# EAGLE design riffle-beta-0.1.7.1 (EAGLE 7.5.0)
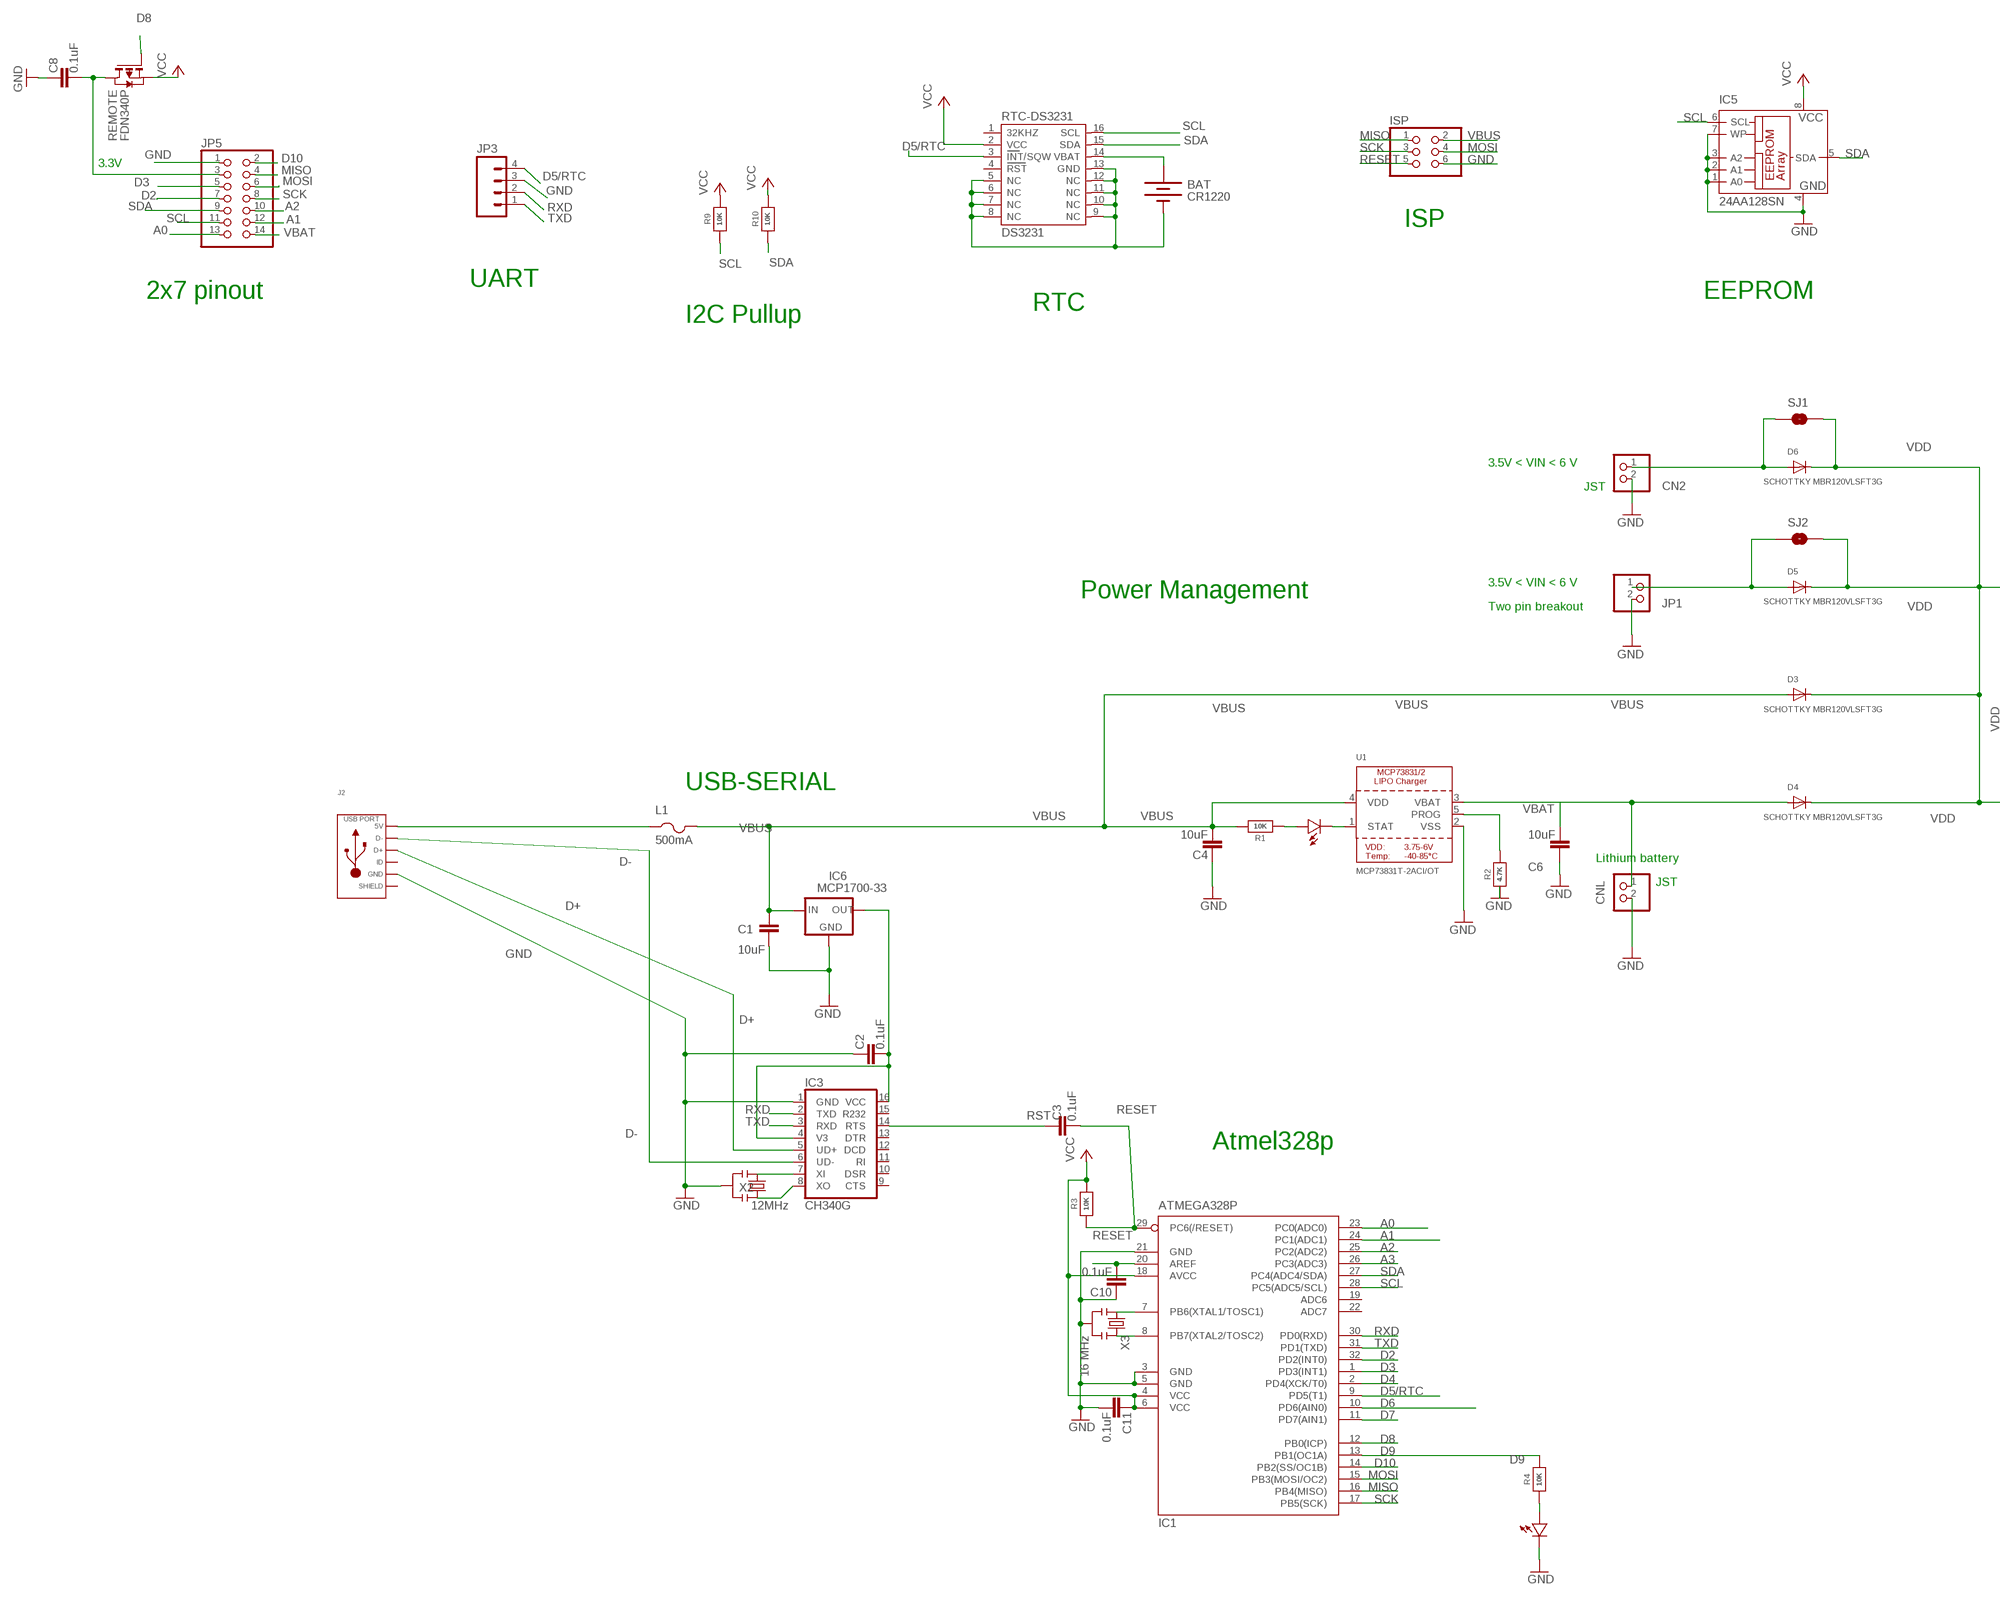
[diagram p0: schematic, sheet 1, part 1 of 2]
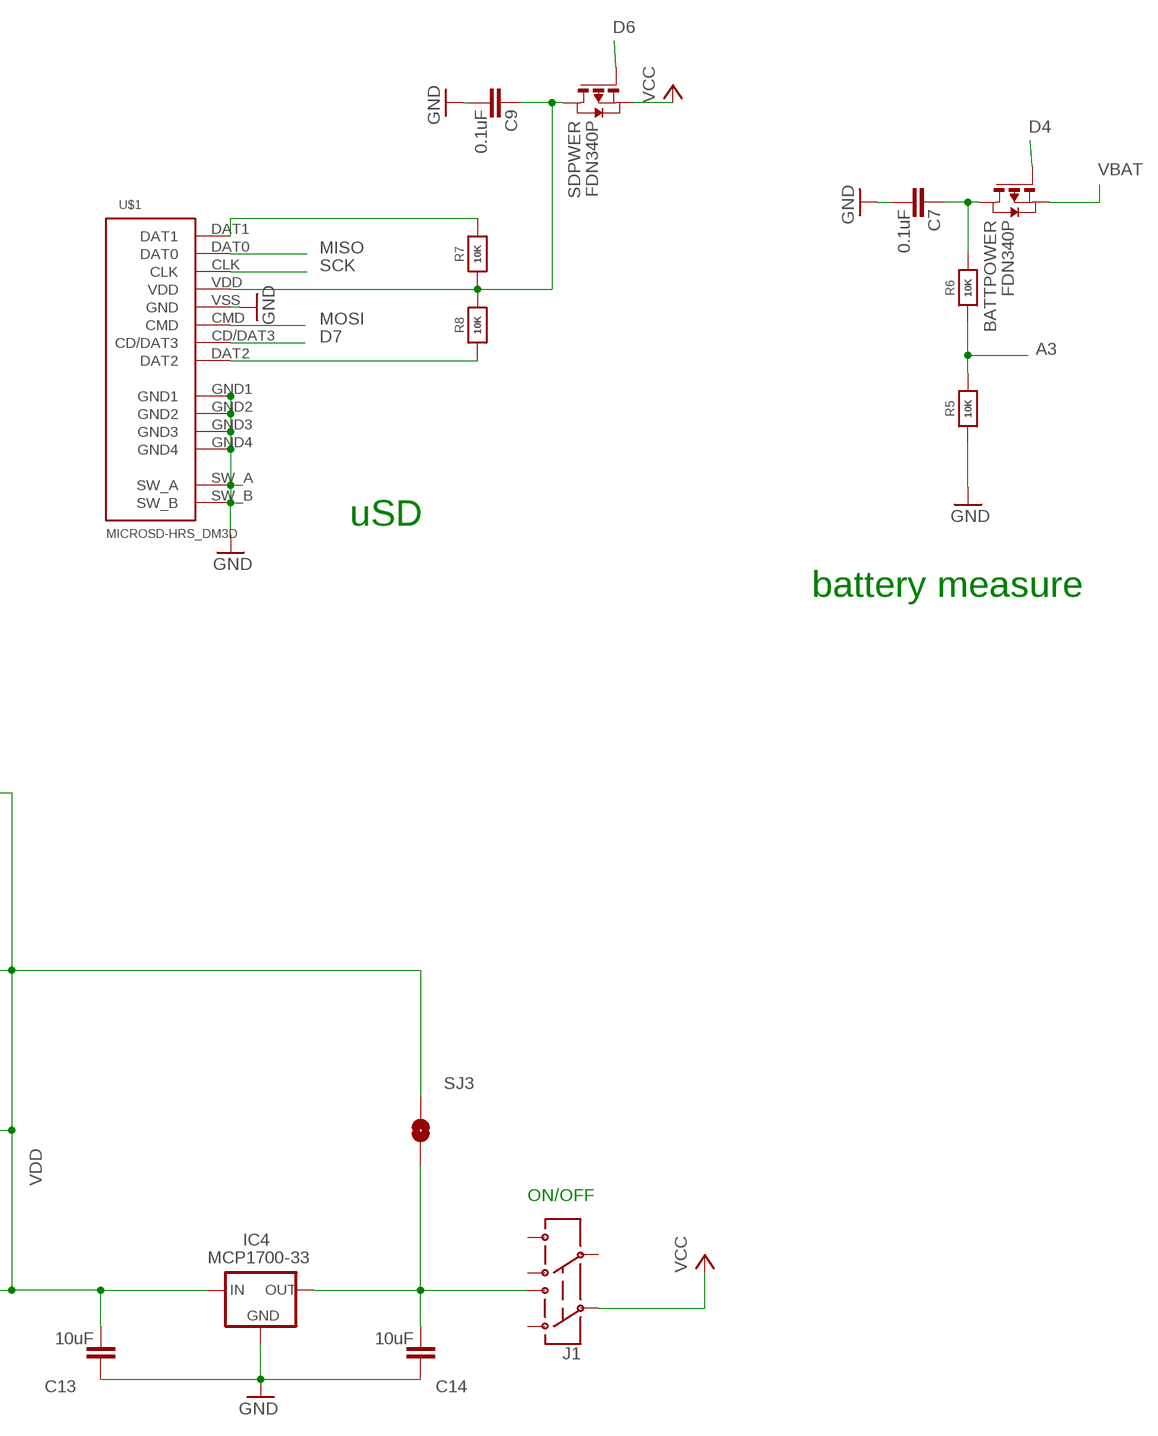
[diagram p1: schematic, sheet 1, part 2 of 2]

## Parts
BAT  CR1220  BATTERYBATTERY_12MM_SMT  [BATTCON_12MM_SMT]
BATTPOWER  FDN340P  PMOSSOT23  [SOT-23]
C1  10uF  CAP0603-CAP  [0603-CAP]
C2  0.1uF  CAP0603-CAP  [0603-CAP]
C3  0.1uF  CAP0603-CAP  [0603-CAP]
C4  10uF  CAP0603-CAP  [0603-CAP]
C6  10uF  CAP0603-CAP  [0603-CAP]
C7  0.1uF  CAP0603-CAP  [0603-CAP]
C8  0.1uF  CAP0603-CAP  [0603-CAP]
C9  0.1uF  CAP0603-CAP  [0603-CAP]
C10  0.1uF  CAP0603-CAP  [0603-CAP]
C11  0.1uF  CAP0603-CAP  [0603-CAP]
C13  10uF  CAP0603-CAP  [0603-CAP]
C14  10uF  CAP0603-CAP  [0603-CAP]
CN2  JST_2PIN-SMT-RA  [JST-PH-2-SMT-RA]
CNL  JST_2PIN-SMT-RA  [JST-PH-2-SMT-RA]
D1  LED0603  [0603-LED]
D2  LED0603  [0603-LED]
D3  SCHOTTKY MBR120VLSFT3G  DIODE_SOD-123FL  [SOD-123FL]
D4  SCHOTTKY MBR120VLSFT3G  DIODE_SOD-123FL  [SOD-123FL]
D5  SCHOTTKY MBR120VLSFT3G  DIODE_SOD-123FL  [SOD-123FL]
D6  SCHOTTKY MBR120VLSFT3G  DIODE_SOD-123FL  [SOD-123FL]
IC1  ATMEGA328P  MEGA8-AI  [TQFP32-08]
IC3  CH340G  [SO16]
IC4  MCP1700-33  MCP1700SOT89  [SOT89]
IC5  24AA128SN  [SO-08]
IC6  MCP1700-33  MCP1700SOT89  [SOT89]
ISP  PINHD-2X3  [2X03]
J1  AYZ0202  [AYZ0202]
J2  USB_MICRO_RIGHT  [MICROUSB-RIGHT]
JP1  PINHD-1X2  [1X02]
JP3  M04SMD  [1X04-SMD]
JP5  PINHD-2X7  [2X07]
L1  500mA  PTCFUSE-1206  [R1206]
R1  10K  RESISTOR_0603_NOOUT  [0603-NO]
R2  4.7K  RESISTOR_0603_NOOUT  [0603-NO]
R3  10K  RESISTOR_0603_NOOUT  [0603-NO]
R4  10K  RESISTOR_0603_NOOUT  [0603-NO]
R5  10K  RESISTOR_0603_NOOUT  [0603-NO]
R6  10K  RESISTOR_0603_NOOUT  [0603-NO]
R7  10K  RESISTOR_0603_NOOUT  [0603-NO]
R8  10K  RESISTOR_0603_NOOUT  [0603-NO]
R9  10K  RESISTOR_0603_NOOUT  [0603-NO]
R10  10K  RESISTOR_0603_NOOUT  [0603-NO]
REMOTE  FDN340P  PMOSSOT23  [SOT-23]
RTC-DS3231  DS3231  [DS3231]
SDPWER  FDN340P  PMOSSOT23  [SOT-23]
SJ1  SOLDERJUMPERNO  [SJ_2S-NO]
SJ2  SOLDERJUMPERNO  [SJ_2S-NO]
SJ3  SOLDERJUMPERNO  [SJ_2S-NO]
U1  MCP73831T-2ACI/OT  MCP73831/2  [SOT23-5]
U$1  MICROSD-HRS_DM3D  [DM3D]
X2  12MHz  RESONATORSMD  [RESONATOR-SMD]
X3  16 MHz  RESONATORSMD  [RESONATOR-SMD]

## Nets
A0: IC1.23(PC0(ADC0)) JP5.13
A1: IC1.24(PC1(ADC1)) JP5.12
A2: IC1.25(PC2(ADC2)) JP5.10
A3: IC1.26(PC3(ADC3)) R5.2 R6.1
AREF: C10.1 IC1.20(AREF)
D2: IC1.32(PD2(INT0)) JP5.7
D3: IC1.1(PD3(INT1)) JP5.5
D4: BATTPOWER.3(G) IC1.2(PD4(XCK/T0))
D5/RTC: IC1.9(PD5(T1)) JP3.4 RTC-DS3231.3(INT/SQW)
D6: IC1.10(PD6(AIN0)) SDPWER.3(G)
D7: IC1.11(PD7(AIN1)) U$1.CD/DAT3
D8: IC1.12(PB0(ICP)) REMOTE.3(G)
D9: IC1.13(PB1(OC1A)) R4.2
D10: IC1.14(PB2(SS/OC1B)) JP5.2
D+: IC3.5(UD+) J2.3(D+)
D-: IC3.6(UD-) J2.2(D-)
GND: BAT.P$1(-) C1.1 C2.2 C4.2 C6.2 C7.1 C8.2 C9.1 C10.2 C11.1 C13.2 C14.2 CN2.2 CNL.2 D2.MINUS IC1.3(GND) IC1.5(GND) IC1.21(GND) IC3.1(GND) IC4.1(GND) IC5.1(A0) IC5.2(A1) IC5.3(A2) IC5.4(GND) IC5.7(WP) IC6.1(GND) ISP.6 J2.5(GND) JP1.2 JP3.3 JP5.1 R2.1 R5.1 RTC-DS3231.5(NC) RTC-DS3231.6(NC) RTC-DS3231.7(NC) RTC-DS3231.8(NC) RTC-DS3231.9(NC) RTC-DS3231.10(NC) RTC-DS3231.11(NC) RTC-DS3231.12(NC) RTC-DS3231.13(GND) U1.2(VSS) U$1.GND1 U$1.GND2 U$1.GND3 U$1.GND4 U$1.SW_A U$1.SW_B U$1.VSS(GND) X2.2 X3.2
MISO: IC1.16(PB4(MISO)) ISP.1 JP5.4 U$1.DAT0
MOSI: IC1.15(PB3(MOSI/OC2)) ISP.4 JP5.6 U$1.CMD
N$2: IC1.7(PB6(XTAL1/TOSC1)) X3.1
N$3: IC1.8(PB7(XTAL2/TOSC2)) X3.3
N$4: C9.2 R7.1 R8.2 SDPWER.1(D) U$1.VDD
N$5: D1.MINUS U1.1(STAT)
N$6: R2.2 U1.5(PROG)
N$7: C8.1 JP5.3 REMOTE.1(D)
N$8: C2.1 IC3.4(V3) IC3.16(VCC) IC6.3(OUT)
N$9: J2.1(5V) L1.1
N$10: D5.A JP1.1 SJ2.1
N$11: IC3.7(XI) X2.1
N$12: CN2.1 D6.A SJ1.1
N$13: IC3.8(XO) X2.3
N$15: BATTPOWER.1(D) C7.2 R6.2
N$16: R7.2 U$1.DAT1
N$17: D2.PLUS R4.1
N$18: R8.1 U$1.DAT2
N$19: D1.PLUS R1.1
N$20: C14.1 IC4.3(OUT) J1.1 SJ3.1
RESET: C3.1 IC1.29(PC6(/RESET)) ISP.5 R3.1
RST: C3.2 IC3.14(RTS)
RTC_BATT: BAT.P$2(+) RTC-DS3231.14(VBAT)
RXD: IC1.30(PD0(RXD)) IC3.2(TXD) JP3.2
SCK: IC1.17(PB5(SCK)) ISP.3 JP5.8 U$1.CLK
SCL: IC1.28(PC5(ADC5/SCL)) IC5.6(SCL) JP5.11 R9.1 RTC-DS3231.16(SCL)
SDA: IC1.27(PC4(ADC4/SDA)) IC5.5(SDA) JP5.9 R10.1 RTC-DS3231.15(SDA)
TXD: IC1.31(PD1(TXD)) IC3.3(RXD) JP3.1
VBAT [power]: BATTPOWER.2(S) C6.1 CNL.1 D4.A JP5.14 U1.3(VBAT)
VBUS [power]: C1.2 C4.1 D3.A IC6.2(IN) ISP.2 L1.2 R1.2 U1.4(VDD)
VCC: C11.2 IC1.4(VCC) IC1.6(VCC) IC1.18(AVCC) IC5.8(VCC) J1.2 R3.2 R9.2 R10.2 REMOTE.2(S) RTC-DS3231.2(VCC) SDPWER.2(S)
VDD: C13.1 D3.C D4.C D5.C D6.C IC4.2(IN) SJ1.2 SJ2.2 SJ3.2
Unconnected: IC1.19(ADC6) IC1.22(ADC7) IC3.9(CTS) IC3.10(DSR) IC3.11(RI) IC3.12(DCD) IC3.13(DTR) IC3.15(R232) J1.3 J1.4 J1.5 J1.6 J2.4(ID) RTC-DS3231.1(32KHZ) RTC-DS3231.4(RST)

## Notes on the sheet
- 3.3V
- ISP
- UART | uSD
- 2x7 pinout | EEPROM
- RTC
- I2C Pullup
- battery measure
- 3.5V < VIN < 6 V
- JST
- 3.5V < VIN < 6 V
- Power Management
- Two pin breakout
- ON/OFF
- USB-SERIAL
- Lithium battery
- JST
- Atmel328p

## Power pins joined to a net without a drawn wire
SLD: J2.S1(SLD) J2.S2(SLD) J2.S3(SLD) J2.S4(SLD) J2.S5(SLD) J2.S6(SLD) J2.S7(SLD) J2.S8(SLD)

## Library data of the parts
BAT = SparkFunNew:BATTERY: Battery Holders Various common sizes : AA, AAA, 20mm coin cell and 12mm coin cell.
BATTPOWER REMOTE SDPWER = zetex:PMOSSOT23: MOS FET; OC_FARNELL: unknown; OC_NEWARK: unknown
C1-C4 C6-C11 C13 C14 = SparkFun:CAP: Capacitor Standard 0603 ceramic capacitor, and 0.1" leaded capacitor.
CN2 CNL = adafruit:JST_2PIN: JST 2-Pin Connectors of various flavors SMT-RA (S2B-PH-SM4) 4UConnector #17311 SMT (B2B-PH-SM4) THM-RA (S2B-PH) THM (B2B-PH)
D1 D2 = LowPowerLab:LED
D3-D6 = adafruit:DIODE: Diode SMADIODE - SMA Surface Mount Package 20V 1A Schottky Diode Digikey: 641-1014-6-ND DO-1N4148 - Through Hole Small Current Diode SOD-123 20V 1 A (.5mV Vf) Schottky Diode - Digikey: MBRX120TPMSCT-ND SOD-323 10V 570mA (.38mV Vf, 3ns) Schottky Diode - Digikey: ZLLS410CT-ND SOD-523 30V 30mA Schottky Diode (RB751S-40TE61) - Digikey: RB751S-40TE61CT-ND SOT23-R/W - SOT23 Package (R = Solder Paste/Reflow Ovens, W = Hand-Soldering) BAT54Film 40V 300mA - Digikey: 497-7162-1-ND
IC1 = atmel:MEGA8: MICROCONTROLLER 8 Kbytes FLASH, 1 kbytes SRAM, 512 bytes EEPROM, USART, 6-channel 10 bit ADC, 2-channel 8 bit ADC Pin compatible with Atmega48, ATMega88, ATMega168 Source: avr.lbr; MPN: ATMEGA8-16AU; OC_FARNELL: 9171371; OC_NEWARK: 73M8863
IC3 = SparkFunNew:CH340
IC4 IC6 = adafruit:MCP1700: VOLTAGE REGULATOR
IC5 = microchip:24*: Serial EEPROM I2C; MF: MICROCHIP; MPN: 24AA128-I/SN; OC_FARNELL: unknown; OC_NEWARK: 92C6842
ISP = pinhead:PINHD-2X3: PIN HEADER
J1 = SparkFunNew:AYZ0202: SPDT Slide Switch Simple SMD single-pull double-throw slide switch. Good for less than 350mA power switch, switching UARTs between devices, etc. Spark Fun Electronics SKU : COM-00597
J2 = MF_Connectors:USB: Library: MF_Connectors Description: 5 Pin USB Connectors. SLD is the shield connection. Usually tied to ground through a small ferrite bead.
JP1 = pinhead:PINHD-1X2: PIN HEADER
JP3 = SparkFun:M04: Header 4 Standard 4-pin 0.1" header. Use with straight break away headers (SKU : PRT-00116), right angle break away headers (PRT-00553), swiss pins (PRT-00743), machine pins (PRT-00117), and female headers (PRT-00115). Molex polarized connector foot print use with SKU : PRT-08231 with associated crimp pins and housings.
JP5 = pinhead:PINHD-2X7: PIN HEADER
L1 = adafruit:PTCFUSE: PTC fuses, resettable thermistors
R1-R10 = microbuilder:RESISTOR: Resistors For new designs, use the packages preceded by an '_' character since they are more reliable: The following footprints should be used on most boards: _0402 - Standard footprint for regular board layouts _0603 - Standard footprint for regular board layouts _0805 - Standard footprint for regular board layouts _1206 - Standard footprint for regular board layouts For extremely tight-pitch boards where space is at a premium, the following 'micro-pitch' footprints can be used (smaller pads, no silkscreen outline, etc.): _0402MP - Micro-pitch footprint for very dense/compact boards _0603MP - Micro-pitch footprint for very dense/compact boards _0805MP - Micro-pitch footprint for very dense/compact boards _1206MP - Micro-pitch footprint for very dense/compact boards
RTC-DS3231 = _lh-library:DS3231
SJ1-SJ3 = SparkFun-Retired:SOLDERJUMPER: Solder Jumper Standard SMD solder jumper. Used to automate production. Two varients : Normally Open and Normally Closed are the same, but have different paste layers. NC will have a large amount of paste and should jumper during reflow.
U1 = microbuilder:MCP73831/2: MCP73831/2 LIPO Charger VDD: 3.75 - 6V Temp -40 - 85°C Programmable Charge Rate: 15-500mA NOTE: STAT is a tri-state logic output on the MCP73831 and an open-drain output on the MCP73832. SOT23-5 with 4.2V output and tri-state logic on STAT = MCP73831T-2ACI/OT
U$1 = hrs_DM3D-SF:MICROSD-HRS_DM3D
X2 = SparkFunNew:RESONATOR: Resonator Small SMD resonator. This is the itty bitty 10/20MHz resonators with built in caps. CSTCE10M0G55 and CSTCE20M0V53. Footprint has been reviewed closely but hasn't been tested yet.
X3 = SparkFun:RESONATOR: Resonator Small SMD resonator. This is the itty bitty 10/20MHz resonators with built in caps. CSTCE10M0G55 and CSTCE20M0V53. Footprint has been reviewed closely but hasn't been tested yet.

## Net classes
1 power: width 0.305 mm

## Board
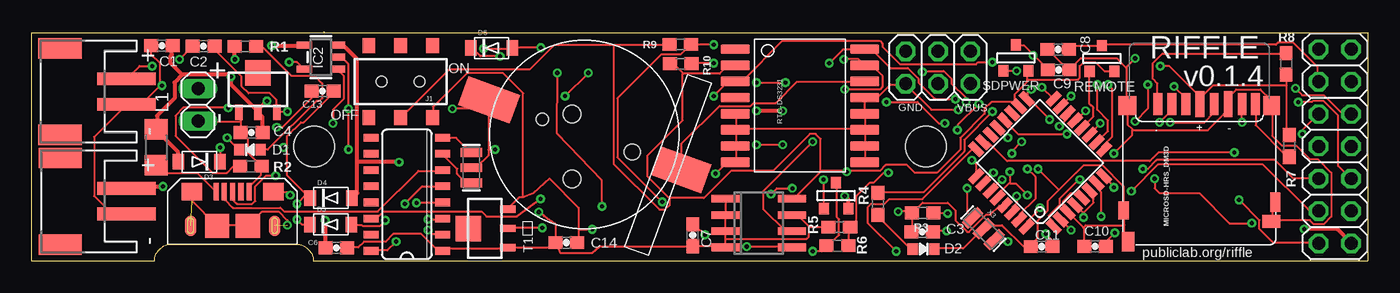
[diagram p2: board, top side]
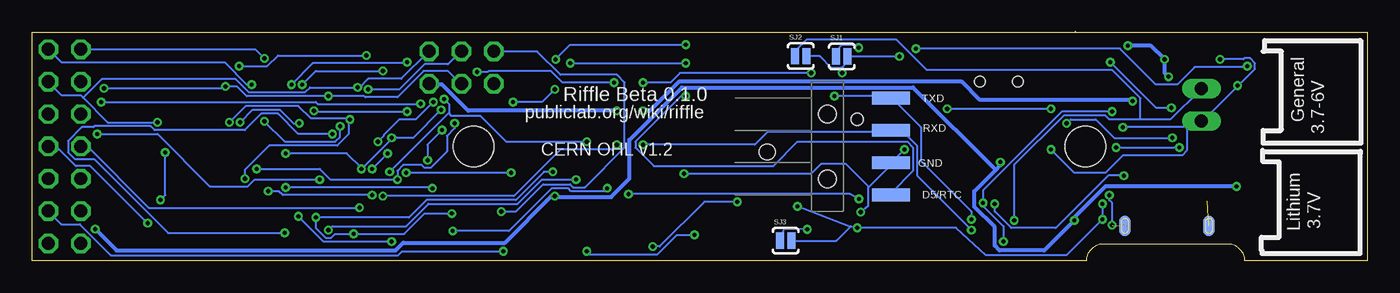
[diagram p3: board, bottom side, seen from below]

Size 104.8 x 18.01 mm. Coordinates in mm from the lower left corner, seen from the top.
Outline: 22.91,18.01 22.96,18.01
Outline: 0,0 0,17.96 104.8,17.96 104.8,0 22.07,0 arc90 20.75,1.32 10.95,1.32 arc90 9.63,0 0,0
Copper layers (1*16): Top 0.0356mm / dielectric 1.5011mm / Bottom 0.0356mm
Design rules "LaenPCBOrder": minimum track width 6mil, minimum drill 13mil, track to track 6mil, track to pad 6mil, pad to pad 6mil, via to via 6mil, smd to smd 6mil, copper to edge 15mil, drill to drill 6mil, minimum pad ring 7mil, minimum via ring 7mil, stop-mask expansion 3mil, vias tented up to drill 0mil, thermal gap 10mil
Holes 3.2 mm at 70.13,9 22.13,9

### Footprints (pad centres in the part's own frame; a part is rotated, then mirrored left to right if it is on the bottom)
BATTCON_12MM_SMT = smd 2.4 x 4.3: P$1 0,11.96 | smd 2.4 x 4.2: P$2 0,-4.1 | hole 0.95: 0,7.5 | hole 1.25: 0,0
SOT-23 = smd 0.787 x 0.889: 1 0.025,-1.016; 2 -0.94,1.016; 3 0.991,1.016
0603-CAP = smd 1.1 x 1: 1 -0.85,0; 2 0.85,0
JST-PH-2-SMT-RA = smd 1 x 4.6: 1 1,-3.7; 2 -1,-3.7 | smd 1.6 x 3.4: NC1 -3.4,1.5; NC2 3.4,1.5
0603-LED = smd 0.8 x 0.9: MINUS -0.85,0; PLUS 0.85,0
SOD-123FL = smd 0.91 x 1.22: A 1.637,0; C -1.637,0
TQFP32-08 = smd 1.27 x 0.559: 1 -4.293,2.8; 2 -4.293,2; 3 -4.293,1.2; 4 -4.293,0.4; 5 -4.293,-0.4; 6 -4.293,-1.2; 7 -4.293,-2; 8 -4.293,-2.8; 17 4.293,-2.8; 18 4.293,-2; 19 4.293,-1.2; 20 4.293,-0.4; 21 4.293,0.4; 22 4.293,1.2; 23 4.293,2; 24 4.293,2.8 | smd 0.559 x 1.27: 9 -2.8,-4.293; 10 -2,-4.293; 11 -1.2,-4.293; 12 -0.4,-4.293; 13 0.4,-4.293; 14 1.2,-4.293; 15 2,-4.293; 16 2.8,-4.293; 25 2.8,4.293; 26 2,4.293; 27 1.2,4.293; 28 0.4,4.293; 29 -0.4,4.293; 30 -1.2,4.293; 31 -2,4.293; 32 -2.8,4.293
SO16 = smd 0.6 x 1.2: 1 -4.445,-2.8; 2 -3.175,-2.8; 3 -1.905,-2.8; 4 -0.635,-2.8; 5 0.635,-2.8; 6 1.905,-2.8; 7 3.175,-2.8; 8 4.445,-2.8; 9 4.445,2.8; 10 3.175,2.8; 11 1.905,2.8; 12 0.635,2.8; 13 -0.635,2.8; 14 -1.905,2.8; 15 -3.175,2.8; 16 -4.445,2.8
SOT89 = smd 0.58 x 1.2: 1 -1.5,-1.8; 2 0,-1.8; 3 1.5,-1.8 | smd 2 x 2: 4 0,1.3
SO-08 = smd 0.6 x 2.2: 1 -1.905,-2.6; 2 -0.635,-2.6; 3 0.635,-2.6; 4 1.905,-2.6; 5 1.905,2.6; 6 0.635,2.6; 7 -0.635,2.6; 8 -1.905,2.6
2X03 = drill 1.016 octagon: 1 -2.54,-1.27; 2 -2.54,1.27; 3 0,-1.27; 4 0,1.27; 5 2.54,-1.27; 6 2.54,1.27
AYZ0202 = smd 1 x 1.15: 1 -2.5,2.825; 2 0,2.825; 3 2.5,2.825; 4 -2.5,-2.825; 5 0,-2.825; 6 2.5,-2.825 | hole 0.85: 1.5,0; -1.5,0
MICROUSB-RIGHT = smd 0.4 x 1.35: 1 -1.3,1.27; 2 -0.65,1.27; 3 0,1.27; 4 0.65,1.27; 5 1.3,1.27 | smd 0.9 x 1.6: S1 -3.3,-1.4; S2 3.3,-1.4 | smd 1.6 x 1.4: S3 -3.2,1.27; S4 3.2,1.27 | smd 1.9 x 1.9: S5 -1.2,-1.405; S6 1.2,-1.405 | smd 0.9 x 1.6 bottom: S7 -3.3,-1.4; S8 3.3,-1.4
1X02 = drill 1.016 long: 1 -1.27,0; 2 1.27,0
1X04-SMD = smd 1 x 3: 1 -3.81,5; 2 -1.27,5; 3 1.27,5; 4 3.81,5 | hole 1.4: -2.54,0; 2.54,0
2X07 = drill 1.016 octagon: 1 -7.62,-1.27; 2 -7.62,1.27; 3 -5.08,-1.27; 4 -5.08,1.27; 5 -2.54,-1.27; 6 -2.54,1.27; 7 0,-1.27; 8 0,1.27; 9 2.54,-1.27; 10 2.54,1.27; 11 5.08,-1.27; 12 5.08,1.27; 13 7.62,-1.27; 14 7.62,1.27
R1206 = smd 1.6 x 1.803: 1 -1.422,0; 2 1.422,0
0603-NO = smd 1.1 x 1: 1 -0.85,0; 2 0.85,0
DS3231 = smd 0.762 x 2.286: 1 -4.445,-5.08; 2 -3.175,-5.08; 3 -1.905,-5.08; 4 -0.635,-5.08; 5 0.635,-5.08; 6 1.905,-5.08; 7 3.175,-5.08; 8 4.445,-5.08; 9 4.445,5.08; 10 3.175,5.08; 11 1.905,5.08; 12 0.635,5.08; 13 -0.635,5.08; 14 -1.905,5.08; 15 -3.175,5.08; 16 -4.445,5.08
SJ_2S-NO = smd 0.635 x 1.27: 1 -0.45,0; 2 0.45,0
SOT23-5 = smd 0.55 x 1.2: 1 -0.95,-1.3; 2 0,-1.3; 3 0.95,-1.3; 4 0.95,1.3; 5 -0.95,1.3
DM3D = smd 0.7 x 1.75: CD/DAT3 8.15,0.45; CLK 4.85,0.45; CMD 7.05,0.45; DAT0 2.65,0.45; DAT1 1.6,0.45; DAT2 9.25,0.45 | smd 0.8 x 1.5: GND1 0.05,8.15 | smd 0.8 x 1.4: GND2 11.95,8.8 | smd 1.4 x 1.5: GND3 11.65,0.55 | smd 1.3 x 1.5: GND4 0.35,0.55 | smd 1 x 1.55: SW_A 11.6,11.25 | smd 1.4 x 1: SW_B 0.35,9.65 | smd 0.7 x 2.032: VDD 5.95,0.45; VSS 3.75,0.45
RESONATOR-SMD = smd 0.7 x 1.7: 1 -1.2,0; 2 0,0; 3 1.2,0

### Placement (x,y rotation side)
BAT  47.1,8.57 70 top
BATTPOWER  63.12,5.14 180 top
C1  10.2,16.92 0 top
C2  13.48,16.89 180 top
C3  69.86,2.3 0 top
C4  17.24,10.1 180 top
C6  23.9,1.04 0 top
C7  51.84,2.03 90 top
C8  80.53,16.62 180 top
C9  80.57,15.01 180 top
C10  83.41,1.16 180 top
C11  79.23,1.13 0 top
C13  22.81,13.36 180 top
C14  41.94,1.45 180 top
CN2  3.71,13.31 90 top
CNL  3.72,4.7 90 top
D1  17.1,8.74 0 top
D2  69.95,0.94 180 top
D3  13.13,7.8 180 top
D4  23.47,4.95 0 top
D5  23.44,2.87 0 top
D6  36.07,16.74 0 top
IC1  79.09,7.72 135 top
IC3  29.42,5.24 90 top
IC4  35.53,2.57 90 top
IC5  57.02,2.98 270 top
IC6  17.73,13.49 0 top
ISP  71.1,15.2 180 top
J1  28.93,14.1 180 top
J2  15.75,4.17 0 top
JP1  13.04,12.26 270 top
JP3  42.39,9 270 bottom
JP5  102.23,9.01 270 top
L1  9.75,8.94 90 top
R1  16.75,16.87 180 top
R2  17.19,7.44 180 top
R3  69.89,3.78 0 top
R4  66.37,4.5 90 top
R5  63.35,2.66 0 top
R6  63.2,1.22 180 top
R7  98.65,9.05 270 top
R8  98.4,15.49 270 top
R9  50.91,15.5 180 top
R10  50.88,17.03 180 top
REMOTE  83.98,15.91 180 top
RTC-DS3231  60.27,12.21 270 top
SDPWER  77.23,15.95 180 top
SJ1  41.25,16.08 0 bottom
SJ2  44.48,16.1 0 bottom
SJ3  45.67,1.6 0 bottom
U1  22.68,16.03 90 top
U$1  97.6,12.78 180 top
X2  34.49,7.33 90 top
X3  74.66,2.55 135 top

### Tracks (layer width: path | path; a pad name or v marks a point on that pad's centre or on a via)
A0  (via drill 0.33)
  Top 0.152: v94.34,8.53 88.39,8.53 87.71,7.85 76.5,7.85 75.06,9.3 74.68,9.3 IC1.23 | v94.72,4.8 96.32,3.2 96.32,2.52 97.38,1.45 100.89,1.45 JP5.13
  Bottom 0.152: v94.34,8.53 94.34,5.18 v94.72,4.8
A1  (via drill 0.33)
  Top 0.152: v67.82,0.76 65.61,2.97 65.61,4.27 65.84,4.5 66.9,4.5 67.28,4.88 69.88,4.88 73.76,8.76 74.07,8.76 IC1.24
  Bottom 0.152: v67.82,0.76 75.74,0.76 76.05,0.46 98.6,0.46 101.04,2.9 102.49,2.9 103.48,3.89 JP5.12
A2  (via drill 0.33)
  Top 0.152: v73.76,7.92 74.07,7.62 74.07,6.71 IC1.25 | v72.62,10.29 72.62,10.67 v74.29,12.34 | v99.36,12.5 100.43,12.5 100.51,12.57 101.35,12.57 102.49,11.43 102.49,7.47 103.48,6.48 JP5.10
  Bottom 0.152: v73.76,7.92 73.76,9.14 v72.62,10.29 | v74.29,12.34 82.37,12.34 82.52,12.5 v99.36,12.5
A3  (via drill 0.33)
  Top 0.152: R6.1 64.08,1.22 64.08,2.52 64.16,2.59 R5.2 64.24,2.67 64.69,3.12 64.69,5.11 65.76,6.17 66.07,6.17 66.83,6.93 v67.21,6.93 | v75.44,6.93 74.68,6.17 IC1.26
  Bottom 0.152: v67.21,6.93 v75.44,6.93
AREF  (via drill 0.33)
  Top 0.152: v84.96,2.21 84.28,1.52 84.28,1.22 C10.1 | v81.23,9.98 77.34,9.98 76.35,10.97 IC1.20
  Bottom 0.152: v84.96,2.21 94.11,2.21 99.9,8 101.42,8 101.96,8.53 101.96,9.45 100.89,10.52 99.97,10.52 99.9,10.59 95.48,10.59 95.17,10.29 88.09,10.29 86.79,11.58 85.5,11.58 83.9,9.98 v81.23,9.98
D2  (via drill 0.33)
  Top 0.152: v79.1,4.19 79.1,4.12 78.1,3.12 78.1,2.74 IC1.32
  Bottom 0.152: v79.1,4.19 95.63,4.19 100.43,8.99 100.89,8.99 JP5.7
D3  (via drill 0.33)
  Top 0.152: v82.22,6.4 82.14,6.4 80.62,4.88 80.62,4.42 79.78,3.58 79.78,3.43 80.09,3.12 80.09,2.74 IC1.1 | v99.67,9.98 99.67,10.29 100.89,11.51 JP5.5
  Bottom 0.152: v82.22,6.4 87.33,6.4 87.86,5.87 90.83,5.87 94.95,9.98 v99.67,9.98
D4  (via drill 0.33)
  Top 0.152: v62.1,6.4 62.1,4.19 BATTPOWER.3 | v81.53,2.44 80.77,3.2 IC1.2
  Bottom 0.152: v62.1,6.4 64.77,6.4 66.67,4.5 73.69,4.5 75.44,2.74 81.23,2.74 v81.53,2.44
D5/RTC  (via drill 0.33)
  Top 0.152: v84.43,13.87 84.73,13.56 84.73,9.75 84.12,9.14 84.12,8.84 IC1.9 | v75.36,15.62 74.22,15.62 74.07,15.47 68.12,15.47 66.75,16.84 66.75,17.07 66.52,17.3 58.9,17.3 55.78,14.17 55.24,14.17 RTC-DS3231.3 55.17,14.1 54.64,14.1 v53.49,12.95
  Bottom 0.152: v84.43,13.87 82.75,15.54 75.44,15.54 v75.36,15.62 | v53.49,12.95 53.87,12.95 57.45,9.37 57.45,8.91 56.01,7.47 46.63,7.47 44.73,9.37 36.12,9.37 35.66,8.91 35.66,7.09 37.34,5.41 37.34,5.26 JP3.4
D6  (via drill 0.33)
  Top 0.152: v77.27,14.94 76.28,14.94 SDPWER.3 | v83.59,13.87 83.59,11.89 84.43,11.05 84.43,10.21 83.59,9.37 IC1.10
  Bottom 0.152: v77.27,14.94 82.52,14.94 v83.59,13.87
D7  (via drill 0.33)
  Top 0.152: v83.82,10.82 82.98,9.98 IC1.11 | v88.47,10.9 89.38,11.81 89.38,12.27 U$1.CD/DAT3
  Bottom 0.152: v83.82,10.82 84.28,10.82 85.34,11.89 87.48,11.89 v88.47,10.9
D8
  Top 0.152: REMOTE.3 82.98,14.86 82.98,12.34 83.29,12.04 83.29,11.35 82.45,10.52 IC1.12
D9  (via drill 0.33)
  Top 0.152: v75.36,11.73 73.15,9.53 73.15,8.61 69.95,5.41 66.45,5.41 R4.2 | v82.68,11.81 81.91,11.05 IC1.13
  Bottom 0.152: v75.36,11.73 82.6,11.73 v82.68,11.81
D10  (via drill 0.33)
  Top 0.152: v80.62,10.59 81.23,11.2 81.23,11.58 IC1.14 | v86.56,10.97 87.55,11.96 v87.55,13.87
  Bottom 0.152: v80.62,10.59 80.62,9.75 81,9.37 84.96,9.37 v86.56,10.97 | v87.55,13.87 87.93,13.87 89.69,15.62 102.49,15.62 103.48,16.61 JP5.2
D+  (via drill 0.33)
  Top 0.152: v29.26,4.5 30.63,5.87 32.16,5.87 IC3.5 | v19.13,6.71 18.36,6.71 17.53,5.87 17.53,4.72 17.3,4.5 16.08,4.5 15.77,4.8 15.77,5.41 J2.3
  Bottom 0.152: v29.26,4.5 29.26,3.89 27.97,2.59 24.46,2.59 20.35,6.71 v19.13,6.71
D-
  Top 0.152: IC3.6 32.16,7.09 30.33,7.09 27.13,3.89 19.81,3.89 19.51,4.19 15.77,4.19 15.16,4.8 15.16,5.41 J2.2
GND  (via drill 0.33)
  Top 0.152: U$1.GND1 97.54,4.57 97.31,4.34 97.31,3.2 U$1.SW_B 97.38,3.2 100.28,3.2 100.58,2.9 101.35,2.9 101.96,3.5 101.96,6.93 100.89,8 100.28,8 99.21,9.07 98.07,9.07 97.31,9.83 97.31,12.19 U$1.GND4 97.23,12.27 97.23,12.65 96.39,13.49 94.49,13.49 93.88,12.88 93.88,12.34 U$1.VSS 93.8,12.27 93.8,11.81 92.28,10.29 86.41,10.29 86.37,10.32 | C8.2 79.71,16.61 81.23,15.09 81.38,15.09 C9.1 81.46,15.09 82.3,15.93 85.12,15.93 85.84,15.2 | 85.84,15.2 85.88,15.16 85.88,12.27 U$1.GND3 85.95,12.19 85.95,10.74 86.37,10.32 | 85.84,15.2 v86.56,15.93 | 85.72,2.82 85.72,1.83 85.95,1.6 U$1.SW_A | 85.72,2.82 85.72,3.96 U$1.GND2 85.65,4.04 85.65,5.87 83.97,7.54 82.52,7.54 80.58,5.6 | 82.49,2.63 81.31,3.81 IC1.3 81.23,3.89 80.92,4.19 80.92,4.72 81.53,5.33 81.69,5.33 81.99,5.03 82.37,5.03 IC1.5 | 82.49,2.63 82.52,2.59 82.52,1.22 C10.2 | 85.72,2.82 82.68,2.82 82.49,2.63 | D2.MINUS 70.87,0.99 73.08,0.99 74.6,2.52 X3.2 74.68,2.59 74.9,2.82 76.12,2.82 77.8,1.14 78.33,1.14 C11.1 78.33,1.22 78.94,1.83 78.94,3.2 79.71,3.96 79.71,4.72 80.58,5.6 | 75.74,10.52 IC1.21 75.82,10.44 v76.58,9.68 | v72.69,11.89 70.56,11.89 68.58,13.87 ISP.6 68.5,13.87 67.36,13.87 66.29,12.8 65.46,12.8 RTC-DS3231.13 65.38,12.8 65.38,11.58 RTC-DS3231.12 65.38,11.51 65.38,10.36 RTC-DS3231.11 | RTC-DS3231.6 55.24,10.36 55.24,11.51 RTC-DS3231.5 | RTC-DS3231.6 55.24,10.29 55.24,9.07 RTC-DS3231.7 55.24,8.99 55.24,7.77 RTC-DS3231.8 55.17,7.7 54.48,7.7 v53.64,6.86 | RTC-DS3231.9 65.38,7.77 65.38,8.99 RTC-DS3231.10 65.38,9.07 65.38,10.29 RTC-DS3231.11 | RTC-DS3231.6 55.32,10.36 65.3,10.36 RTC-DS3231.11
  Top 0.152: v78.94,7.24 80.58,5.6 | v84.89,8.46 86.33,9.91 86.33,10.29 86.37,10.32 | 10.06,13.79 10.06,15.54 9.37,16.23 9.37,16.92 C1.1 | 10.06,13.79 8.61,12.34 7.47,12.34 CN2.2 7.39,12.27 4.88,9.75 4.88,5.11 6.25,3.73 7.39,3.73 CNL.2 | J2.5 17.07,5.49 17.07,5.87 17.98,6.78 17.98,7.39 R2.1 17.98,7.47 16.92,8.53 16.92,9.6 16.46,10.06 C4.2 16.38,10.13 16.38,10.97 | 16.38,10.97 16.38,11.51 16.23,11.66 IC6.1 | v19.2,10.52 19.66,10.52 21.95,12.8 21.95,13.34 C13.2 | v11.58,15.85 12.57,16.84 C2.2 | v24.84,8.76 v24.84,11.96 24.84,15.47 24.31,16 24,16 U1.2 | 16.38,10.97 13.11,10.97 JP1.2 | v10.21,13.79 10.06,13.79 | 61,2.71 60.12,3.58 59.66,3.58 IC5.7 | 61,2.71 61.04,2.67 62.48,2.67 R5.1 | IC5.1 54.41,4.88 54.41,3.66 IC5.2 54.41,3.58 54.41,2.36 IC5.3 54.41,2.29 54.41,1.75 | IC5.4 54.41,1.14 51.89,1.14 C7.1 51.82,1.14 44.53,1.17 43.97,0.64 41.45,0.64 41.07,1.6 C14.2 | 54.41,1.07 IC5.4 | 54.41,1.75 54.41,1.22 IC5.4 | 54.41,1.75 60.81,1.75 60.96,1.91 60.96,2.67 61,2.71 | 35.81,11.96 35.81,12.65 BAT.P$1 35.81,11.96 | 35.81,11.96 35.81,8.76 | 35.81,8.76 35.81,8.31 34.9,7.39 34.52,7.39 X2.2 | 35.81,8.76 v36.35,8.76 | C14.2 40.61,1.07 IC4.1 37.26,0.99 32.46,0.99 32.31,0.84 IC3.1 | C6.2 24.76,1.07 25.6,1.07 26.06,1.52 27.74,1.52 28.35,2.13 30.56,2.13 31.85,0.84 32.16,0.84 IC3.1 | 32.23,0.84 IC3.1 | v39.78,3.83 40.18,3.53 40.46,3.33 41.07,2.9 C14.2 | 35.81,11.96 v32.99,11.96
  Bottom 0.152: v86.56,15.93 87.25,16.61 100.89,16.61 JP5.1 | 76.5,9.68 74.9,9.68 v72.69,11.89 | 76.5,9.68 v78.94,7.24 78.94,7.32 80.09,8.46 v84.89,8.46 | 76.5,9.68 v76.58,9.68 | 14.17,10.52 13.56,10.52 13.11,10.97 JP1.2 | 14.17,10.52 v19.2,10.52 | v11.58,15.85 9.75,15.85 9.68,15.93 9.22,15.93 8.84,15.54 8.84,15.09 10.17,13.75 | 10.17,13.75 12.88,11.05 13.03,11.05 JP1.2 | v24.84,8.76 23.01,6.93 20.57,6.93 19.2,8.31 14.55,8.31 14.17,8.69 14.17,10.52 | 14.17,10.52 JP1.2 | v10.21,13.79 10.17,13.75 | v36.35,8.76 37.34,7.77 JP3.3 37.41,7.7 37.41,7.54 39.13,5.83 | 39.13,5.83 39.17,5.79 39.17,4.37 39.78,3.86 v39.78,3.83 | v32.99,11.96 v24.84,11.96 | v53.64,6.86 43.66,6.86 42.9,7.62 40.92,7.62 39.13,5.83
MISO  (via drill 0.33)
  Top 0.152: v79.25,13.64 80.09,12.8 IC1.16 | v94.95,10.9 94.95,12.27 U$1.DAT0
  Bottom 0.152: ISP.1 73.69,16.46 75.82,14.33 78.41,14.33 79.1,13.64 v79.25,13.64 82.98,13.64 83.36,13.26 87.78,13.26 88.85,14.33 99.29,14.33 100.77,12.84 | v94.95,10.9 98.83,10.9 100.77,12.84 | 100.77,12.84 100.96,13.03 102.49,13.03 103.48,14.02 JP5.4
MOSI  (via drill 0.33)
  Top 0.152: v81.53,12.95 80.77,12.19 IC1.15 | v89.61,13.72 90.53,12.8 90.53,12.34 U$1.CMD | v99.14,13.56 99.67,13.03 101.35,13.03 102.79,11.58 103.48,11.58 JP5.6
  Bottom 0.152: ISP.4 71.17,13.95 72.16,14.94 74.07,14.94 76.12,12.88 78.64,12.88 78.71,12.95 v81.53,12.95 87.93,12.95 88.7,13.72 v89.61,13.72 89.76,13.56 v99.14,13.56
N$2  (via drill 0.33)
  Top 0.152: v83.9,3.5 83.9,5.41 83.59,5.71 83.59,6.1 IC1.7 | v76.58,1.52 75.67,1.52 75.51,1.68 X3.1
  Bottom 0.152: v83.9,3.5 81.91,1.52 v76.58,1.52
N$3  (via drill 0.33)
  Top 0.152: v84.89,5.79 84.89,5.87 84.12,6.63 IC1.8 | v73.38,5.71 73.38,3.81 73.76,3.43 X3.3
  Bottom 0.152: v84.89,5.79 73.46,5.79 v73.38,5.71
N$4  (via drill 0.33)
  Top 0.152: 78.6,16.19 79.71,15.09 C9.2 | 78.6,16.19 77.88,16.92 77.27,16.92 SDPWER.1 | 98.45,13.79 98.45,10.06 98.6,9.91 R7.1 | 98.45,13.79 98.45,14.63 R8.2 | 98.45,13.79 92.66,13.79 91.67,12.8 91.67,12.34 U$1.VDD 91.67,12.88 89.23,15.32 v88.54,15.32 | v78.56,16.15 78.6,16.19
  Bottom 0.152: v78.56,16.15 85.5,16.15 86.33,15.32 v88.54,15.32
N$5  (via drill 0.33)
  Top 0.152: v15.32,9.68 16.23,8.76 D1.MINUS | v23.62,10.82 23.62,11.89 24.46,12.72 24.46,14.55 24,15.01 U1.1
  Bottom 0.152: v15.32,9.68 19.89,9.68 21.34,11.12 23.32,11.12 v23.62,10.82
N$6  (via drill 0.33)
  Top 0.152: v15.39,12.04 11.89,12.04 11.28,11.43 11.28,9.83 14.17,6.93 15.32,6.93 15.77,7.39 16.31,7.39 R2.2 | v20.19,15.62 20.8,15.62 21.34,15.09 U1.5
  Bottom 0.152: v15.39,12.04 16.61,12.04 v20.19,15.62
N$7
  Top 0.152: C8.1 81.38,16.69 81.61,16.92 83.9,16.92 REMOTE.1 83.97,16.99 97.61,16.99 97.76,17.14 98.98,17.14 100.89,15.24 100.89,14.1 JP5.3
N$8  (via drill 0.33)
  Top 0.152: v28.57,1.52 27.89,0.84 26.67,0.84 IC3.16 | v30.18,4.57 32.16,4.57 IC3.4 | C2.1 14.4,16.84 14.4,16.54 16.46,14.48 16.46,13.72 16.99,13.18 18.67,13.18 19.2,12.65 19.2,11.73 IC6.3 19.28,11.73 v20.04,11.73
  Bottom 0.152: v28.57,1.52 28.57,2.74 30.18,4.34 v30.18,4.57 30.18,5.56 24,11.73 v20.04,11.73
N$9
  Top 0.152: J2.1 14.4,5.49 12.95,6.93 10.29,6.93 9.75,7.47 L1.1
N$10  (via drill 0.33)
  Top 0.152: v27.74,3.2 27.28,2.74 25.98,2.74 25.91,2.82 25.15,2.82 D5.A
  Bottom 0.152: v27.74,3.2 27.74,7.54 23.85,11.43 20.57,11.43 20.27,11.12 17.83,11.12 | 17.83,11.12 15.47,11.12 13.11,13.49 JP1.1 | 17.83,11.12 17.83,12.8 20.04,15.01 34.59,15.01 36.96,17.37 44.04,17.37 44.88,16.54 44.88,16.15 SJ2.1
N$11
  Top 0.152: IC3.7 32.23,8.38 33.38,7.24 33.38,6.86 34.06,6.17 34.44,6.17 X2.1
N$12  (via drill 0.33)
  Top 0.152: v39.93,16.76 37.72,16.76 D6.A 37.64,16.69 v35.43,16.69 | v9.45,15.32 8.46,15.32 7.47,14.33 CN2.1
  Bottom 0.152: v39.93,16.76 40.16,16.76 40.39,16.99 41.22,16.99 41.68,16.54 41.68,16.08 SJ1.1 | v35.43,16.69 19.43,16.69 16.61,13.87 14.94,13.87 13.56,15.24 9.52,15.24 v9.45,15.32
N$13
  Top 0.152: IC3.8 32.23,9.68 33.3,9.68 34.44,8.53 X2.3
N$15  (via drill 0.33)
  Top 0.152: BATTPOWER.1 63.17,6.1 63.17,3.43 63.32,3.28 63.32,2.06 62.41,1.14 R6.2 62.33,1.14 61.95,0.76 v61.26,0.76 | v52.81,2.06 52.04,2.82 51.89,2.82 C7.2
  Bottom 0.152: v52.81,2.06 54.18,2.06 55.7,0.53 61.04,0.53 v61.26,0.76
N$16
  Top 0.152: R7.2 98.6,8.23 98.45,8.23 96.01,10.67 96.01,12.27 U$1.DAT1
N$17
  Top 0.152: D2.PLUS 69.04,0.99 68.88,0.99 66.45,3.43 66.45,3.58 R4.1
N$18
  Top 0.152: R8.1 98.37,16.31 88.7,16.31 87.93,15.54 87.93,14.33 88.32,13.95 88.32,12.34 U$1.DAT2
N$19
  Top 0.152: D1.PLUS 17.98,8.76 18.52,8.76 22.33,12.57 22.56,12.57 22.78,12.8 22.78,13.95 22.17,14.55 20.35,14.55 18.06,16.84 17.6,16.84 R1.1
N$20  (via drill 0.33)
  Top 0.152: 42.9,2.49 42.9,4.19 40.61,6.48 39.34,5.33 38.56,5.03 | 42.9,2.49 42.9,1.6 C14.1 | 38.56,5.03 38.25,5.03 37.34,4.12 IC4.3 | 38.56,5.03 38.56,13.18 36.96,14.78 34.14,14.78 31.47,12.12 31.47,11.28 J1.1 | 42.9,2.49 v43.97,2.49
  Bottom 0.152: v43.97,2.49 45.8,2.52 SJ3.1
RESET  (via drill 0.33)
  Top 0.152: C3.1 69.04,2.36 69.04,3.73 R3.1 | IC1.29 76.28,4.34 75.9,4.34 75.21,3.66 74.9,3.66 73.53,2.29 73.38,2.29 72.47,3.2 72.47,3.96 71.86,4.57 69.88,4.57 69.11,3.81 R3.1 | v67.97,3.89 68.81,3.89 68.96,3.73 R3.1
  Bottom 0.152: v67.97,3.89 66.83,3.89 64.69,6.02 62.56,6.02 62.33,5.79 61.42,5.79 58.29,8.91 58.29,14.02 58.9,14.63 63.32,14.63 65.15,16.46 68.5,16.46 ISP.5
RST  (via drill 0.33)
  Top 0.152: v71.78,2.36 70.71,2.36 C3.2 | v59.66,5.71 58.45,5.71 v57.99,5.26 | v39.9,4.88 39.27,4.45 38.02,3.5 35.66,3.5 35.28,3.89 27.58,3.89 27.05,3.35 26.67,3.35 IC3.14
  Bottom 0.152: v71.78,2.36 67.36,2.36 64.01,5.71 62.71,5.71 62.48,5.49 59.89,5.49 v59.66,5.71 | v57.99,5.26 40.61,5.26 v39.9,4.88
RTC_BATT
  Top 0.152: RTC-DS3231.14 65.3,14.1 60.05,14.1 58.37,12.42 56.62,12.42 56.39,12.19 53.95,12.19 50.98,9.22 50.98,7.24 BAT.P$2
RXD  (via drill 0.33)
  Top 0.152: v31.09,2.44 31.39,2.13 32.16,2.13 IC3.2 | v77.27,5.11 77.27,4.57 76.96,4.27 76.96,3.89 IC1.30 | v56.85,9.14 v58.9,9.14
  Bottom 0.152: v31.09,2.44 35.36,6.71 35.36,9.07 36.5,10.21 37.34,10.21 JP3.2 37.34,10.13 47.09,10.13 48.08,9.14 v56.85,9.14 | v77.27,5.11 66.98,5.11 63.32,8.76 59.28,8.76 v58.9,9.14
SCK  (via drill 0.33)
  Top 0.152: v78.41,13.49 78.1,13.18 78.1,12.8 IC1.17 78.18,12.8 v79.86,11.12 | v89.31,10.9 91.97,10.9 92.74,11.66 92.74,12.27 U$1.CLK | v95.71,2.97 93.95,2.97 91.59,5.33 88.47,5.33 88.09,5.71 v88.09,6.48
  Bottom 0.152: v78.41,13.49 75.97,13.49 73.99,15.47 72.16,15.47 71.17,16.46 ISP.3 | v89.31,10.9 88.01,12.19 83.9,12.19 82.91,11.2 79.93,11.2 v79.86,11.12 79.93,11.12 79.93,9.98 80.85,9.07 86.18,9.07 88.09,7.16 v88.09,6.48 | v95.71,2.97 100.2,7.47 101.35,7.47 102.87,8.99 103.48,8.99 JP5.8
SCL  (via drill 0.33)
  Top 0.152: v53.49,15.54 51.82,15.54 R9.1 | v62.56,15.54 63.63,16.61 65.3,16.61 RTC-DS3231.16 65.38,16.61 65.91,16.61 67.36,15.16 68.73,15.16 69.57,14.33 69.57,14.02 70.87,12.72 v72.47,12.72 | 76.7,6.13 76.73,6.17 v76.73,7.01 | 76.7,6.13 75.82,5.26 75.82,5.03 IC1.28 | v61.26,9.37 57.38,5.49 57.38,4.12 59.13,2.36 59.59,2.36 IC5.6 | v86.26,5.49 88.39,7.62 96.55,7.62 100.2,3.96 100.89,3.96 JP5.11 | v78.1,5.18 77.19,6.1 76.73,6.1 76.7,6.13
  Bottom 0.152: v62.56,15.54 v53.49,15.54 | 72.12,11.62 72.09,11.66 72.09,12.34 v72.47,12.72 | 72.12,11.62 v76.73,7.01 | v61.26,9.37 67.59,9.37 69.65,11.43 71.93,11.43 72.12,11.62 | v86.26,5.49 85.42,5.49 85.12,5.18 v78.1,5.18
SDA  (via drill 0.33)
  Top 0.152: v76.12,6.4 76.05,6.4 75.21,5.56 IC1.27 | v87.17,7.24 87.55,7.24 88.24,7.92 97.54,7.92 98.98,6.48 100.89,6.48 JP5.9 | v53.49,16.99 51.74,16.99 R10.1 51.66,16.99 50.9,16.23 49.38,16.23 45.95,12.8 45.95,8.15 v49.45,4.65 | v63.7,15.85 64.85,15.85 65.3,15.39 RTC-DS3231.15 65.38,15.32 65.99,15.32 66.75,14.55 66.75,13.72 66.52,13.49 v63.78,13.49 | v56.08,1.14 59.59,1.14 IC5.5 | v71.63,10.82 71.17,10.82 69.49,12.5 v67.06,12.5
  Bottom 0.152: v87.17,7.24 82.22,7.24 81.38,6.4 v76.12,6.4 76.12,7.09 75.67,7.54 74.22,7.54 73.99,7.32 73.53,7.32 72.24,8.61 72.24,9.83 71.63,10.44 v71.63,10.82 | v53.49,16.99 62.56,16.99 v63.7,15.85 | v56.08,1.14 55.55,1.14 52.04,4.65 v49.45,4.65 | v67.06,12.5 64.77,12.5 v63.78,13.49
SLD  (via drill 0.33)  (4 unrouted)
  Top 0.152: J2.S3 12.57,5.41 12.57,4.72 14.48,2.82 J2.S5 14.55,2.82 16.92,2.82 J2.S6 16.99,2.82 18.06,3.89 19.35,3.89 20.04,3.2 v20.04,2.82 | v20.27,5.18 20.04,5.41 18.97,5.41 J2.S4
  Bottom 0.152: v20.27,5.18 20.27,4.8 20.04,4.57 v20.04,2.82
TXD  (via drill 0.33)
  Top 0.152: v31.09,3.28 32.16,3.28 IC3.3 | v78.1,7.24 78.71,6.63 78.71,4.88 77.5,3.66 77.5,3.28 IC1.31 | v76.89,8.46 76.89,8.61 v77.65,9.37 | v73.3,12.5 73.3,12.8 72.16,13.95 72.16,14.33 71.55,14.94 69.95,14.94 v69.88,14.86 | v56.85,14.02 v59.13,14.02 | v41.83,12.95 v43.66,14.78
  Bottom 0.152: v31.09,3.28 31.09,3.89 35.05,7.85 35.05,10.52 37.34,12.8 JP3.1 37.41,12.88 37.49,12.95 v41.83,12.95 | v76.89,8.46 v78.1,7.24 | v77.65,9.37 77.19,9.83 77.19,9.91 75.97,11.12 74.68,11.12 v73.3,12.5 | v69.88,14.86 69.04,14.86 68.96,14.94 64.08,14.94 63.17,14.02 v59.13,14.02 | v56.85,14.02 54.71,14.02 53.95,14.78 v43.66,14.78
VBAT  (via drill 0.33)
  Top 0.305: 25.53,7.77 25.53,5.33 25.15,4.95 D4.A | 25.53,7.77 25.53,15.85 24.46,16.92 24,16.92 U1.3 | v23.01,3.2 23.01,1.07 C6.1 | v10.29,5.87 7.62,5.87 7.47,5.71 CNL.1 | v28.8,7.77 25.53,7.77 | v63.78,5.11 64.01,4.88 64.01,4.19 BATTPOWER.2 | v99.82,2.52 102.41,2.52 103.48,1.45 JP5.14
  Bottom 0.305: v10.29,5.87 20.57,5.87 23.01,3.43 v23.01,3.2 25.37,0.84 28.88,0.84 29.26,1.22 29.26,2.67 30.86,4.27 30.86,5.49 29.18,7.16 | v28.8,7.77 28.8,7.54 29.18,7.16 | v99.82,2.52 98.15,0.84 76.28,0.84 75.67,1.45 67.67,1.45 64.01,5.11 v63.78,5.11 63.7,5.03 59.36,5.03 57.91,6.48 57.91,9.53 53.8,13.64 35.66,13.64 29.18,7.16
VBUS  (via drill 0.33)
  Top 0.305: D3.A 11.43,7.85 11.43,8.61 9.75,10.29 L1.2 9.83,10.44 9.83,11.43 11.2,12.8 11.2,14.02 11.81,14.63 | C4.1 18.06,10.13 18.06,11.35 17.75,11.66 IC6.2 | v15.93,15.85 15.93,16.84 R1.2 | IC6.2 17.68,11.81 15.62,13.87 v15.62,14.48 15.47,14.63 11.81,14.63 | 11.81,14.63 10.9,15.54 10.9,16.15 10.97,16.23 10.97,16.92 C1.2 | v18.82,16.92 21.34,16.92 U1.4 | v56.85,11.81 v58.9,11.81 | v18.44,12.57 17.75,11.89 IC6.2
  Bottom 0.305: v15.62,14.48 15.93,14.78 v15.93,15.85 16.99,16.92 v18.82,16.92 | v58.9,11.81 70.56,11.81 72.62,13.87 73.61,13.87 ISP.2 | v56.85,11.81 56.31,11.81 54.03,14.1 31.85,14.1 30.4,12.65 18.52,12.65 v18.44,12.57
VCC  (via drill 0.33)
  Top 0.152: 51.09,14.74 51.13,14.71 53.95,14.71 54.56,15.32 55.17,15.32 RTC-DS3231.2 | 51.09,14.74 50.37,15.47 50.06,15.47 R9.2 | 45.64,16.99 41,16.99 39.09,15.09 32.77,15.09 28.96,11.28 J1.2 | 45.64,16.99 49.99,16.99 R10.2 | 50.03,4.92 50.06,4.88 50.06,4.42 49.68,4.04 49.23,4.04 45.64,7.62 45.64,16.99 | 50.03,4.92 48.31,6.63 48.31,8.31 51.05,11.05 51.05,14.71 51.09,14.74 | v79.55,2.13 80.01,1.68 80.01,1.14 C11.2 | v82.52,3.43 82.52,3.73 82.49,3.77 | 82.49,3.77 81.91,4.34 IC1.4 | v71.86,3.73 70.79,3.73 R3.2 | 82.49,3.77 83.29,4.57 83.29,4.88 82.98,5.18 82.98,5.49 IC1.6 | 59.59,4.88 IC5.8 59.66,4.95 59.82,4.95 61.91,7.05 | 78.1,14.25 78.1,14.1 77.11,13.11 77.11,12.5 | 78.1,14.25 78.1,14.94 SDPWER.2 | 77.11,12.5 77.42,12.19 IC1.18 77.11,12.5 | 78.1,14.25 82.07,14.25 82.22,14.4 82.22,15.32 82.52,15.62 83.44,15.62 84.12,14.94 84.89,14.94 REMOTE.2 | 61.91,7.05 61.95,7.09 63.93,7.09 | 63.93,7.09 66.52,7.09 66.98,7.54 68.66,7.54 69.27,6.93 71.02,6.93 72.85,8.76 72.85,9.68 74.75,11.58 74.75,11.96 75.29,12.5 77.11,12.5 | 63.93,7.09 v63.93,7.01 | 50.03,4.92 50.06,4.95 52.73,4.95 54.86,7.09 58.14,7.09 61.04,9.98 61.49,9.98 61.87,9.6 61.87,7.09 61.91,7.05
  Bottom 0.152: v71.86,3.73 73.99,3.73 75.59,2.13 v79.55,2.13 81,2.13 81.31,1.83 81.76,1.83 82.52,2.59 v82.52,3.43 75.21,3.43 73.84,4.8 66.83,4.8 64.62,7.01 v63.93,7.01
VDD  (via drill 0.33)
  Top 0.152: v36.73,16.08 35.2,16.08 34.59,16.69 34.44,16.69 D6.C | v40.06,2.62 40.03,2.59 37.34,2.59 IC4.2 | 20.04,8.91 20.04,6.71 21.79,4.95 D4.C 21.49,5.18 v20.8,4.5 | 20.04,8.91 20.04,9.83 21.11,10.9 21.34,10.9 23.62,13.18 23.62,13.34 C13.1 | v14.78,8.91 14.78,7.85 D3.C | 20.04,8.91 v19.74,8.91 | v20.8,3.28 21.18,2.9 21.79,2.9 D5.C | 44.73,4.22 v44.73,4.29 44.73,6.33 41.2,10.03 v41.22,14.78
  Bottom 0.152: v36.73,16.08 SJ1.2 40.84,16.08 40.84,15.62 41.26,15.2 | 41.26,15.2 41.3,15.16 42.06,15.16 42.98,16.08 43.97,16.08 SJ2.2 | 40.58,2.71 41.68,1.6 SJ3.2 | 40.58,2.71 40.54,2.74 v40.06,2.62 32.28,2.62 29.95,0.46 23.62,0.46 v20.8,3.28 v20.8,4.5 | v19.74,8.91 v14.78,8.91 | v41.22,14.78 41.22,15.16 41.26,15.2 | 40.58,2.71 v44.73,4.29

### Text on the board
tPlace: ON | RIFFLE | IC2 | + | v0.1.4 | - | OFF | GND | VBUS | T1 | publiclab.org/riffle
bPlace: General | Riffle Beta 0.1.0 | TXD | RXD | publiclab.org/wiki/riffle | 3.7-6V | GND | CERN OHL v1.2 | Lithium | D5/RTC | 3.7V